# EAGLE design analog_frontend (EAGLE 9.5.2)
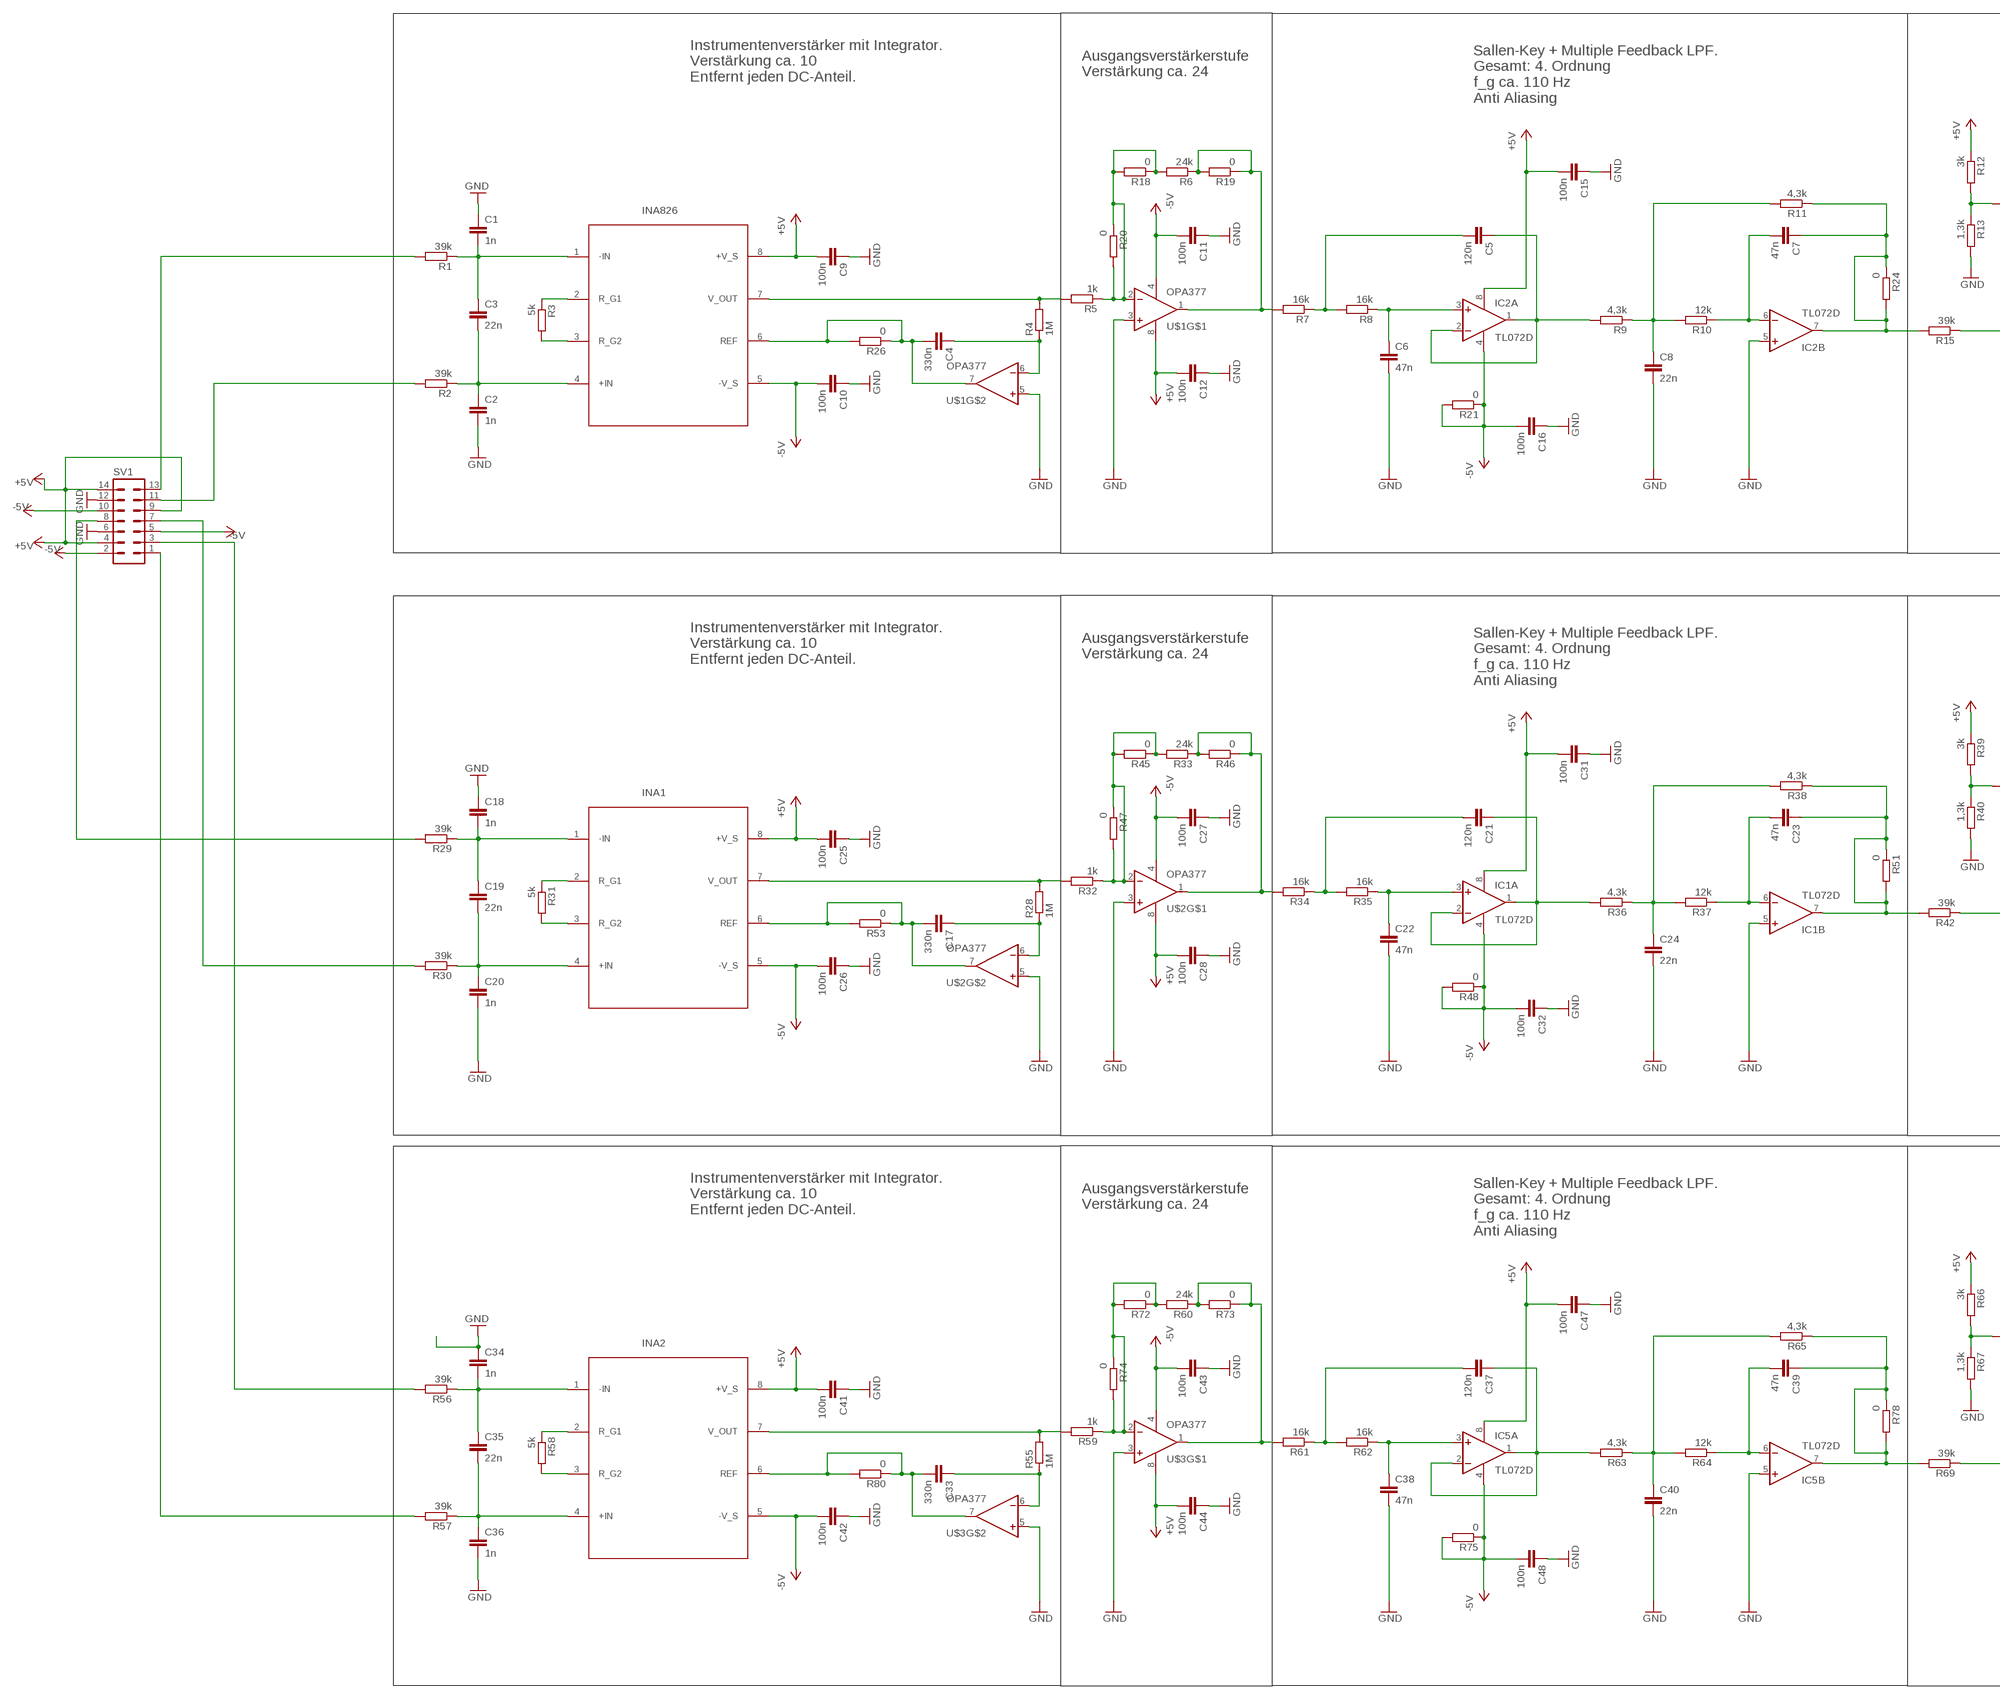
[diagram p0: schematic, sheet 1, part 1 of 2]
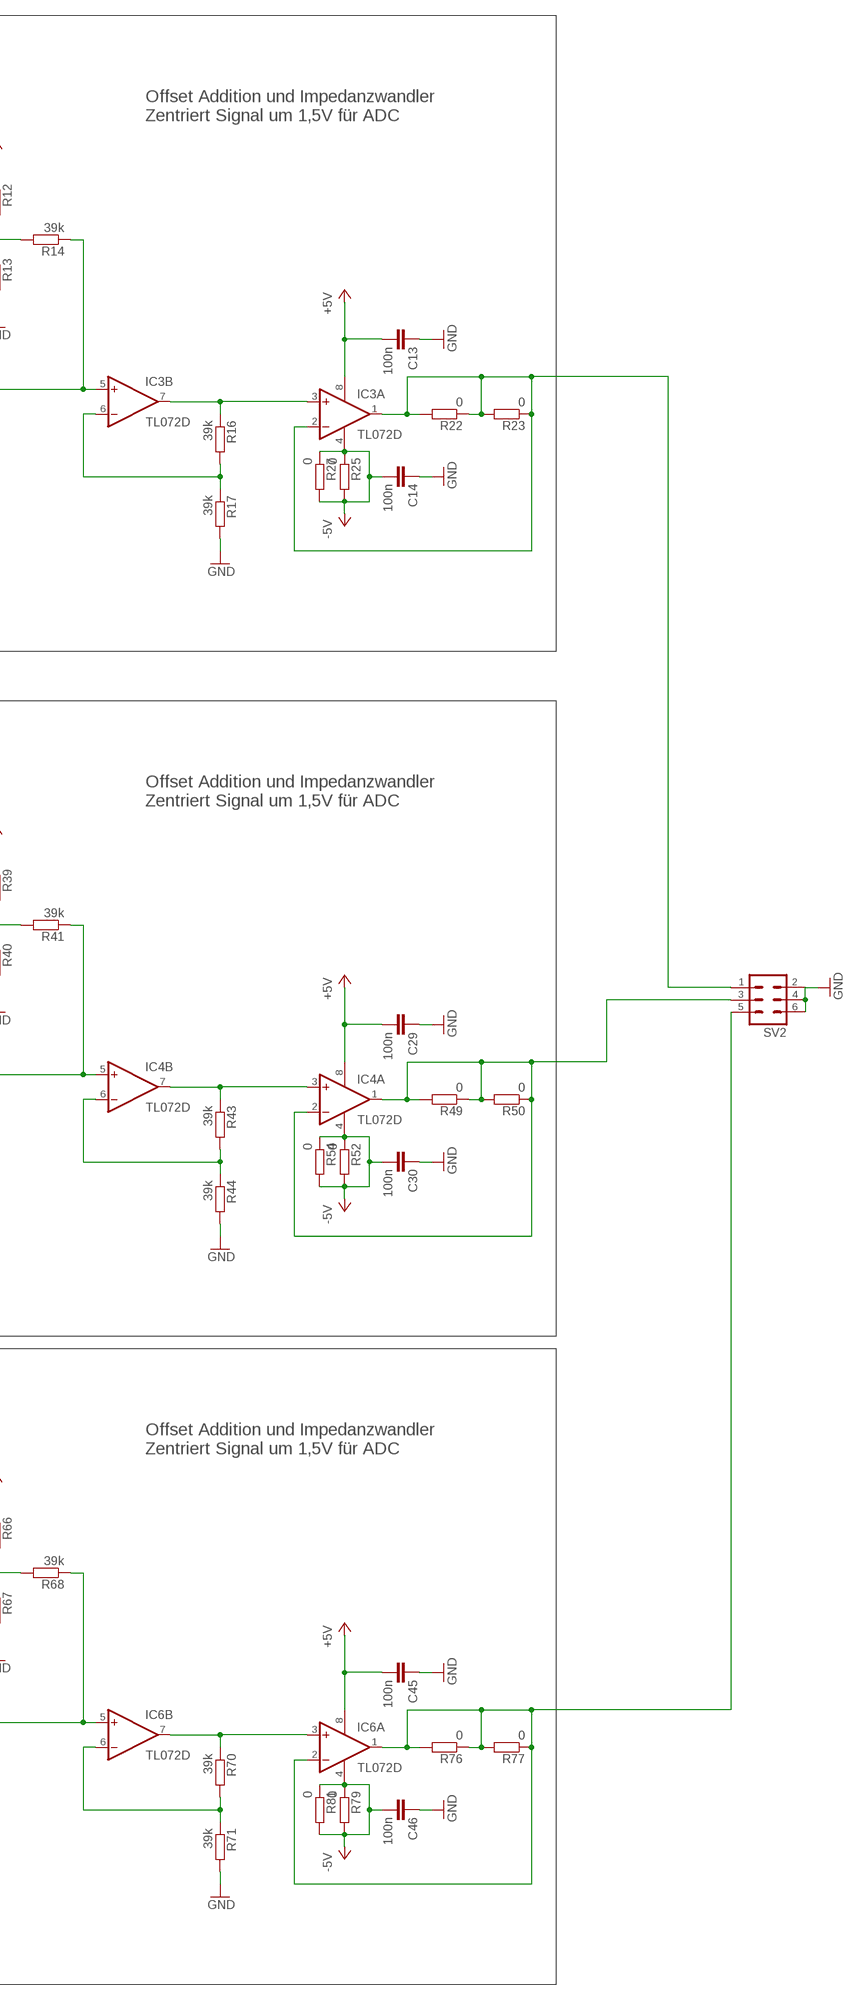
[diagram p1: schematic, sheet 1, part 2 of 2]

## Parts
C1  1n  C-EUC0805  [C0805]
C2  1n  C-EUC0805  [C0805]
C3  22n  C-EUC0805  [C0805]
C4  330n  C-EUC1206  [C1206]
C5  120n  C-EUC0805  [C0805]
C6  47n  C-EUC0805  [C0805]
C7  47n  C-EUC0805  [C0805]
C8  22n  C-EUC0805  [C0805]
C9  100n  C-EUC0805  [C0805]
C10  100n  C-EUC0805  [C0805]
C11  100n  C-EUC0805  [C0805]
C12  100n  C-EUC0805  [C0805]
C13  100n  C-EUC0805  [C0805]
C14  100n  C-EUC0805  [C0805]
C15  100n  C-EUC1206  [C1206]
C16  100n  C-EUC0805  [C0805]
C17  330n  C-EUC1206  [C1206]
C18  1n  C-EUC0805  [C0805]
C19  22n  C-EUC0805  [C0805]
C20  1n  C-EUC0805  [C0805]
C21  120n  C-EUC0805  [C0805]
C22  47n  C-EUC0805  [C0805]
C23  47n  C-EUC0805  [C0805]
C24  22n  C-EUC0805  [C0805]
C25  100n  C-EUC0805  [C0805]
C26  100n  C-EUC0805  [C0805]
C27  100n  C-EUC0805  [C0805]
C28  100n  C-EUC0805  [C0805]
C29  100n  C-EUC0805  [C0805]
C30  100n  C-EUC0805  [C0805]
C31  100n  C-EUC1206  [C1206]
C32  100n  C-EUC0805  [C0805]
C33  330n  C-EUC1206  [C1206]
C34  1n  C-EUC0805  [C0805]
C35  22n  C-EUC0805  [C0805]
C36  1n  C-EUC0805  [C0805]
C37  120n  C-EUC0805  [C0805]
C38  47n  C-EUC0805  [C0805]
C39  47n  C-EUC0805  [C0805]
C40  22n  C-EUC0805  [C0805]
C41  100n  C-EUC0805  [C0805]
C42  100n  C-EUC0805  [C0805]
C43  100n  C-EUC0805  [C0805]
C44  100n  C-EUC0805  [C0805]
C45  100n  C-EUC0805  [C0805]
C46  100n  C-EUC0805  [C0805]
C47  100n  C-EUC1206  [C1206]
C48  100n  C-EUC0805  [C0805]
IC1  TL072D  [SO08]
IC2  TL072D  [SO08]
IC3  TL072D  [SO08]
IC4  TL072D  [SO08]
IC5  TL072D  [SO08]
IC6  TL072D  [SO08]
INA1  INA826  [SOIC8]
INA2  INA826  [SOIC8]
INA826  INA826  [SOIC8]
R1  39k  R-EU_R0805  [R0805]
R2  39k  R-EU_R0805  [R0805]
R3  5k  R-EU_R0805  [R0805]
R4  1M  R-EU_R1206  [R1206]
R5  1k  R-EU_R1206  [R1206]
R6  24k  R-EU_R0805  [R0805]
R7  16k  R-EU_R1206  [R1206]
R8  16k  R-EU_R0805  [R0805]
R9  4,3k  R-EU_R0805  [R0805]
R10  12k  R-EU_R0805  [R0805]
R11  4,3k  R-EU_R0805  [R0805]
R12  3k  R-EU_R0805  [R0805]
R13  1,3k  R-EU_R1206  [R1206]
R14  39k  R-EU_R0805  [R0805]
R15  39k  R-EU_R0805  [R0805]
R16  39k  R-EU_R0805  [R0805]
R17  39k  R-EU_R1206  [R1206]
R18  0  R-EU_R1206  [R1206]
R19  0  R-EU_R1206  [R1206]
R20  0  R-EU_R1206  [R1206]
R21  0  R-EU_R1206  [R1206]
R22  0  R-EU_R1206  [R1206]
R23  0  R-EU_R1206  [R1206]
R24  0  R-EU_R1206  [R1206]
R25  0  R-EU_R1206  [R1206]
R26  0  R-EU_R1206  [R1206]
R27  0  R-EU_R1206  [R1206]
R28  1M  R-EU_R1206  [R1206]
R29  39k  R-EU_R0805  [R0805]
R30  39k  R-EU_R0805  [R0805]
R31  5k  R-EU_R0805  [R0805]
R32  1k  R-EU_R1206  [R1206]
R33  24k  R-EU_R0805  [R0805]
R34  16k  R-EU_R1206  [R1206]
R35  16k  R-EU_R0805  [R0805]
R36  4,3k  R-EU_R0805  [R0805]
R37  12k  R-EU_R0805  [R0805]
R38  4,3k  R-EU_R0805  [R0805]
R39  3k  R-EU_R0805  [R0805]
R40  1,3k  R-EU_R1206  [R1206]
R41  39k  R-EU_R0805  [R0805]
R42  39k  R-EU_R0805  [R0805]
R43  39k  R-EU_R0805  [R0805]
R44  39k  R-EU_R1206  [R1206]
R45  0  R-EU_R1206  [R1206]
R46  0  R-EU_R1206  [R1206]
R47  0  R-EU_R1206  [R1206]
R48  0  R-EU_R1206  [R1206]
R49  0  R-EU_R1206  [R1206]
R50  0  R-EU_R1206  [R1206]
R51  0  R-EU_R1206  [R1206]
R52  0  R-EU_R1206  [R1206]
R53  0  R-EU_R1206  [R1206]
R54  0  R-EU_R1206  [R1206]
R55  1M  R-EU_R1206  [R1206]
R56  39k  R-EU_R0805  [R0805]
R57  39k  R-EU_R0805  [R0805]
R58  5k  R-EU_R0805  [R0805]
R59  1k  R-EU_R1206  [R1206]
R60  24k  R-EU_R0805  [R0805]
R61  16k  R-EU_R1206  [R1206]
R62  16k  R-EU_R0805  [R0805]
R63  4,3k  R-EU_R0805  [R0805]
R64  12k  R-EU_R0805  [R0805]
R65  4,3k  R-EU_R0805  [R0805]
R66  3k  R-EU_R0805  [R0805]
R67  1,3k  R-EU_R1206  [R1206]
R68  39k  R-EU_R0805  [R0805]
R69  39k  R-EU_R0805  [R0805]
R70  39k  R-EU_R0805  [R0805]
R71  39k  R-EU_R1206  [R1206]
R72  0  R-EU_R1206  [R1206]
R73  0  R-EU_R1206  [R1206]
R74  0  R-EU_R1206  [R1206]
R75  0  R-EU_R1206  [R1206]
R76  0  R-EU_R1206  [R1206]
R77  0  R-EU_R1206  [R1206]
R78  0  R-EU_R1206  [R1206]
R79  0  R-EU_R1206  [R1206]
R80  0  R-EU_R1206  [R1206]
R81  0  R-EU_R1206  [R1206]
SV1  ML14L  [ML14L]
SV2  ML6L  [ML6L]
U$1  OPA377  [SOIC8]
U$2  OPA377  [SOIC8]
U$3  OPA377  [SOIC8]

## Nets
+5V: C9.2 C12.2 C13.2 C15.2 C25.2 C28.2 C29.2 C31.2 C41.2 C44.2 C45.2 C47.2 IC1.8(P:V+) IC2.8(P:V+) IC3.8(P:V+) IC4.8(P:V+) IC5.8(P:V+) IC6.8(P:V+) INA1.8(+V_S) INA2.8(+V_S) INA826.8(+V_S) R12.1 R39.1 R66.1 SV1.4 SV1.9 SV1.14 U$1.8(V+) U$2.8(V+) U$3.8(V+)
-5V: C10.2 C11.2 C14.2 C16.2 C26.2 C27.2 C30.2 C32.2 C42.2 C43.2 C46.2 C48.2 IC1.4(P:V-) IC2.4(P:V-) IC3.4(P:V-) IC4.4(P:V-) IC5.4(P:V-) IC6.4(P:V-) INA1.5(-V_S) INA2.5(-V_S) INA826.5(-V_S) R21.1 R21.2 R25.1 R25.2 R27.1 R27.2 R48.1 R48.2 R52.1 R52.2 R54.1 R54.2 R75.1 R75.2 R79.1 R79.2 R81.1 R81.2 SV1.2 SV1.5 SV1.10 U$1.4(V-) U$2.4(V-) U$3.4(V-)
GND: C1.1 C2.2 C6.2 C8.2 C9.1 C10.1 C11.1 C12.1 C13.1 C14.1 C15.1 C16.1 C18.1 C20.2 C22.2 C24.2 C25.1 C26.1 C27.1 C28.1 C29.1 C30.1 C31.1 C32.1 C34.1 C36.2 C38.2 C40.2 C41.1 C42.1 C43.1 C44.1 C45.1 C46.1 C47.1 C48.1 IC1.5(B:+IN) IC2.5(B:+IN) IC5.5(B:+IN) R13.2 R17.2 R40.2 R44.2 R67.2 R71.2 SV1.6 SV1.12 SV2.2 SV2.4 SV2.6 U$1.3(+IN) U$1.5(+IN) U$2.3(+IN) U$2.5(+IN) U$3.3(+IN) U$3.5(+IN)
N$1: C4.2 INA826.6(REF) R26.1 R26.2 U$1.7(OUT)
N$2: C4.1 R4.1 U$1.6(-IN)
N$3: INA826.7(V_OUT) R4.2 R5.2
N$4: C1.2 C3.1 INA826.1(-IN) R1.1
N$5: C2.1 C3.2 INA826.4(+IN) R2.1
N$6: INA826.3(R_G2) R3.2
N$7: INA826.2(R_G1) R3.1
N$8: R5.1 R6.2 R18.1 R18.2 R20.1 R20.2 U$1.2(-IN)
N$9: R6.1 R7.2 R19.1 R19.2 U$1.1(OUT)
N$10: C5.2 R7.1 R8.2
N$11: C5.1 IC2.1(A:OUT) IC2.2(A:-IN) R9.2
N$12: C6.1 IC2.3(A:+IN) R8.1
N$13: C8.1 R9.1 R10.2 R11.2
N$14: C7.2 IC2.6(B:-IN) R10.1
N$15: C7.1 IC2.7(B:OUT) R11.1 R15.2 R24.1 R24.2
N$16: IC3.5(B:+IN) R14.1 R15.1
N$17: IC3.6(B:-IN) R16.2 R17.1
N$18: R12.2 R13.1 R14.2
N$19: IC3.3(A:+IN) IC3.7(B:OUT) R16.1
N$20: IC3.1(A:OUT) IC3.2(A:-IN) R22.1 R22.2 R23.1 R23.2 SV2.1
N$21: R1.2 SV1.13
N$22: R2.2 SV1.11
N$23: INA1.7(V_OUT) R28.2 R32.2
N$24: C17.1 R28.1 U$2.6(-IN)
N$25: C18.2 C19.1 INA1.1(-IN) R29.1
N$26: C19.2 C20.1 INA1.4(+IN) R30.1
N$27: INA1.3(R_G2) R31.2
N$28: INA1.2(R_G1) R31.1
N$29: C21.2 R34.1 R35.2
N$30: C21.1 IC1.1(A:OUT) IC1.2(A:-IN) R36.2
N$31: C22.1 IC1.3(A:+IN) R35.1
N$32: C24.1 R36.1 R37.2 R38.2
N$33: C23.2 IC1.6(B:-IN) R37.1
N$34: C23.1 IC1.7(B:OUT) R38.1 R42.2 R51.1 R51.2
N$35: IC4.5(B:+IN) R41.1 R42.1
N$36: R39.2 R40.1 R41.2
N$37: IC4.3(A:+IN) IC4.7(B:OUT) R43.1
N$38: IC4.6(B:-IN) R43.2 R44.1
N$39: R32.1 R33.2 R45.1 R45.2 R47.1 R47.2 U$2.2(-IN)
N$40: IC4.1(A:OUT) IC4.2(A:-IN) R49.1 R49.2 R50.1 R50.2 SV2.3
N$41: C17.2 INA1.6(REF) R53.1 R53.2 U$2.7(OUT)
N$42: R33.1 R34.2 R46.1 R46.2 U$2.1(OUT)
N$43: R29.2 SV1.8
N$44: R30.2 SV1.7
N$45: INA2.7(V_OUT) R55.2 R59.2
N$46: C33.1 R55.1 U$3.6(-IN)
N$47: C34.2 C35.1 INA2.1(-IN) R56.1
N$48: C35.2 C36.1 INA2.4(+IN) R57.1
N$49: INA2.3(R_G2) R58.2
N$50: INA2.2(R_G1) R58.1
N$51: C37.2 R61.1 R62.2
N$52: C37.1 IC5.1(A:OUT) IC5.2(A:-IN) R63.2
N$53: C38.1 IC5.3(A:+IN) R62.1
N$54: C40.1 R63.1 R64.2 R65.2
N$55: C39.2 IC5.6(B:-IN) R64.1
N$56: C39.1 IC5.7(B:OUT) R65.1 R69.2 R78.1 R78.2
N$57: IC6.5(B:+IN) R68.1 R69.1
N$58: R66.2 R67.1 R68.2
N$59: IC6.3(A:+IN) IC6.7(B:OUT) R70.1
N$60: IC6.6(B:-IN) R70.2 R71.1
N$61: R59.1 R60.2 R72.1 R72.2 R74.1 R74.2 U$3.2(-IN)
N$62: IC6.1(A:OUT) IC6.2(A:-IN) R76.1 R76.2 R77.1 R77.2 SV2.5
N$63: C33.2 INA2.6(REF) R80.1 R80.2 U$3.7(OUT)
N$64: R60.1 R61.2 R73.1 R73.2 U$3.1(OUT)
N$65: R56.2 SV1.3
N$66: R57.2 SV1.1

## Notes on the sheet
- Instrumentenverstärker mit Integrator. 
  Verstärkung ca. 10
  Entfernt jeden DC-Anteil.
- Ausgangsverstärkerstufe
  Verstärkung ca. 24
- Sallen-Key + Multiple Feedback LPF.
  Gesamt: 4. Ordnung 
  f_g ca. 110 Hz
  Anti Aliasing
- Offset Addition und Impedanzwandler
  Zentriert Signal um 1,5V für ADC
- Instrumentenverstärker mit Integrator. 
  Verstärkung ca. 10
  Entfernt jeden DC-Anteil.
- Ausgangsverstärkerstufe
  Verstärkung ca. 24
- Sallen-Key + Multiple Feedback LPF.
  Gesamt: 4. Ordnung 
  f_g ca. 110 Hz
  Anti Aliasing
- Offset Addition und Impedanzwandler
  Zentriert Signal um 1,5V für ADC
- Instrumentenverstärker mit Integrator. 
  Verstärkung ca. 10
  Entfernt jeden DC-Anteil.
- Ausgangsverstärkerstufe
  Verstärkung ca. 24
- Sallen-Key + Multiple Feedback LPF.
  Gesamt: 4. Ordnung 
  f_g ca. 110 Hz
  Anti Aliasing
- Offset Addition und Impedanzwandler
  Zentriert Signal um 1,5V für ADC

## Library data of the parts
C1-C48 = rcl:C-EU: CAPACITOR, European symbol; SPICEPREFIX: C
IC1-IC6 = linear:TL072: OP AMP
INA1 INA2 INA826 = INA826:INA826: INA826AIDR Texas Instruments InAmp https://www.ti.com/lit/ds/symlink/ina826.pdf
R1-R81 = rcl:R-EU_: RESISTOR, European symbol; SPICEPREFIX: R
SV1 = con-harting-ml:ML14: HARTING; OC_FARNELL: unknown; OC_NEWARK: unknown
SV2 = con-harting-ml:ML6: HARTING; OC_FARNELL: unknown; OC_NEWARK: unknown
U$1-U$3 = OPA377:OPA377

## Board
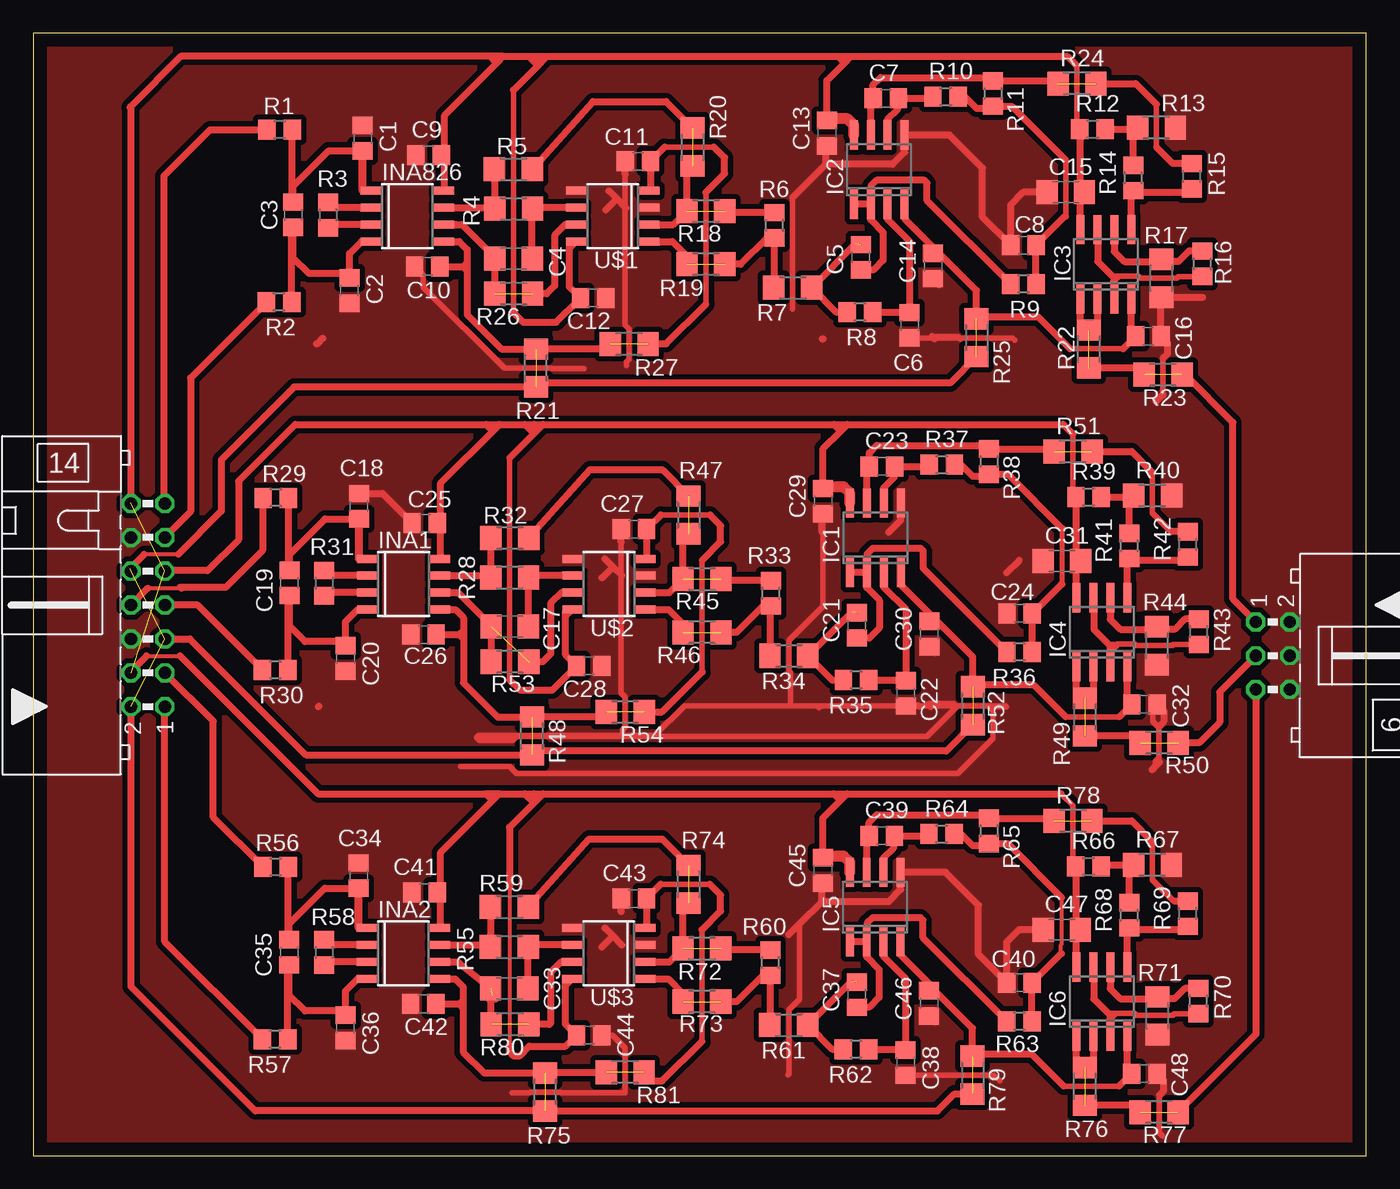
[diagram p2: board, top side]

Size 100 x 84.2 mm. Coordinates in mm from the lower left corner, seen from the top.
Outline: 0,0 100,0 100,84.2 0,84.2 0,0
Copper layers (1*16): Top 0.035mm / dielectric 1.5mm / Bottom 0.035mm
Design rules "default *": minimum track width 6mil, minimum drill 0.35mm, track to track 0.4mm, track to pad 0.4mm, pad to pad 0.25mm, via to via 0.25mm, smd to smd 0.25mm, copper to edge 40mil, drill to drill 1mm, minimum pad ring 10mil, minimum via ring 8mil, stop-mask expansion 4mil, vias tented up to drill 0mil, thermal gap 10mil

### Footprints (pad centres in the part's own frame; a part is rotated, then mirrored left to right if it is on the bottom)
C0805 = smd 1.3 x 1.5: 1 -0.95,0; 2 0.95,0
C1206 = smd 1.6 x 1.8: 1 -1.4,0; 2 1.4,0
SO08 = smd 0.6 x 2.2: 1 -1.905,-2.6; 2 -0.635,-2.6; 3 0.635,-2.6; 4 1.905,-2.6; 5 1.905,2.6; 6 0.635,2.6; 7 -0.635,2.6; 8 -1.905,2.6
SOIC8 = smd 0.6 x 1.5: 1 -1.905,-2.75; 2 -0.635,-2.75; 3 0.635,-2.75; 4 1.905,-2.75; 5 1.905,2.75; 6 0.635,2.75; 7 -0.635,2.75; 8 -1.905,2.75
R0805 = smd 1.3 x 1.5: 1 -0.95,0; 2 0.95,0
R1206 = smd 1.6 x 1.803: 1 -1.422,0; 2 1.422,0
ML14L = drill 0.914 octagon: 1 -7.62,-1.27; 2 -7.62,1.27; 3 -5.08,-1.27; 4 -5.08,1.27; 5 -2.54,-1.27; 6 -2.54,1.27; 7 0,-1.27; 8 0,1.27; 9 2.54,-1.27; 10 2.54,1.27; 11 5.08,-1.27; 12 5.08,1.27; 13 7.62,-1.27; 14 7.62,1.27
ML6L = drill 0.914 octagon: 1 -2.54,-1.27; 2 -2.54,1.27; 3 0,-1.27; 4 0,1.27; 5 2.54,-1.27; 6 2.54,1.27

### Placement (x,y rotation side)
C1  24.72,76.33 270 top
C2  23.72,64.9 270 top
C3  19.51,70.58 270 top
C4  36.03,67.3 180 top
C5  62.08,67.39 90 top
C6  65.74,62.29 270 top
C7  63.96,79.32 0 top
C8  74.28,68.29 180 top
C9  29.66,75.06 0 top
C10  29.56,66.7 0 top
C11  45.35,74.6 0 top
C12  42,64.35 180 top
C13  59.54,76.71 90 top
C14  67.51,66.74 90 top
C15  77.46,72.27 0 top
C16  83.66,61.47 180 top
C17  35.74,39.7 180 top
C18  24.43,48.72 270 top
C19  19.22,42.97 270 top
C20  23.43,37.29 270 top
C21  61.79,39.78 90 top
C22  65.45,34.68 270 top
C23  63.67,51.71 0 top
C24  73.99,40.68 180 top
C25  29.37,47.45 0 top
C26  29.27,39.09 0 top
C27  45.06,46.99 0 top
C28  41.71,36.74 180 top
C29  59.25,49.1 90 top
C30  67.22,39.13 90 top
C31  77.17,44.61 0 top
C32  83.37,33.86 180 top
C33  35.71,12.55 180 top
C34  24.42,21.01 270 top
C35  19.21,15.26 270 top
C36  23.42,9.58 270 top
C37  61.78,12.07 90 top
C38  65.44,6.97 270 top
C39  63.66,24 0 top
C40  73.98,12.97 180 top
C41  29.36,19.74 0 top
C42  29.26,11.38 0 top
C43  45.05,19.28 0 top
C44  41.7,9.03 180 top
C45  59.24,21.39 90 top
C46  67.21,11.42 90 top
C47  77.16,16.95 0 top
C48  83.36,6.15 180 top
IC1  63.17,46.36 0 top
IC2  63.46,73.97 0 top
IC3  80.46,66.87 0 top
IC4  80.17,39.26 0 top
IC5  63.16,18.65 0 top
IC6  80.16,11.55 0 top
INA1  27.78,42.87 270 top
INA2  27.77,15.16 270 top
INA826  28.07,70.48 270 top
R1  18.48,76.96 180 top
R2  18.44,64.04 180 top
R3  22.12,70.56 270 top
R4  36.04,71.03 180 top
R5  36.02,73.99 180 top
R6  55.62,69.79 90 top
R7  56.98,65.11 180 top
R8  62.02,63.29 180 top
R9  74.28,65.39 180 top
R10  68.44,79.45 0 top
R11  72,79.68 270 top
R12  79.46,77.02 0 top
R13  84.26,77.12 0 top
R14  82.52,73.35 90 top
R15  86.91,73.47 90 top
R16  87.72,66.91 90 top
R17  84.63,65.81 270 top
R18  50.46,70.87 180 top
R19  50.46,66.87 0 top
R20  49.46,75.67 90 top
R21  37.71,59.09 270 top
R22  79.2,60.51 270 top
R23  84.76,58.58 0 top
R24  78.3,80.43 0 top
R25  70.77,61.36 90 top
R26  36.04,64.66 0 top
R27  44.7,60.88 0 top
R28  35.74,43.37 180 top
R29  18.19,49.35 180 top
R30  18.15,36.43 180 top
R31  21.83,42.95 270 top
R32  35.75,46.34 180 top
R33  55.33,42.18 90 top
R34  56.69,37.5 180 top
R35  61.73,35.68 180 top
R36  73.99,37.78 180 top
R37  68.15,51.84 0 top
R38  71.71,52.07 270 top
R39  79.17,49.41 0 top
R40  83.97,49.51 0 top
R41  82.23,45.74 90 top
R42  86.62,45.86 90 top
R43  87.43,39.3 90 top
R44  84.31,38.25 270 top
R45  50.17,43.26 180 top
R46  50.17,39.26 0 top
R47  49.17,48.06 90 top
R48  37.42,31.48 270 top
R49  78.91,32.9 270 top
R50  84.47,30.97 0 top
R51  78.01,52.82 0 top
R52  70.48,33.75 90 top
R53  35.76,37.05 0 top
R54  44.41,33.27 0 top
R55  35.71,15.65 180 top
R56  18.18,21.64 180 top
R57  18.14,8.72 180 top
R58  21.82,15.24 270 top
R59  35.71,18.65 180 top
R60  55.32,14.47 90 top
R61  56.68,9.79 180 top
R62  61.72,7.97 180 top
R63  73.98,10.07 180 top
R64  68.14,24.13 0 top
R65  71.7,24.36 270 top
R66  79.16,21.7 0 top
R67  83.96,21.8 0 top
R68  82.22,18.03 90 top
R69  86.61,18.15 90 top
R70  87.42,11.59 90 top
R71  84.33,10.49 270 top
R72  50.16,15.55 180 top
R73  50.16,11.55 0 top
R74  49.16,20.35 90 top
R75  38.41,4.77 270 top
R76  78.9,5.19 270 top
R77  84.46,3.26 0 top
R78  78,25.11 0 top
R79  70.47,6.04 90 top
R80  35.76,9.84 0 top
R81  44.4,6.26 0 top
SV1  8.6,41.3 90 top
SV2  93,37.5 270 top
U$1  43.48,70.48 90 top
U$2  43.19,42.87 90 top
U$3  43.18,15.16 90 top

### Tracks (layer width: path | path; a pad name or v marks a point on that pad's centre or on a via)
+5V  (3 unrouted)
  Top 0.305: 8.49,37.49 11.01,37.49 | 35.73,20.2 35.73,8.3
  Top 0.4: 78.29,77.24 78.29,81.76 | 36.03,63.26 36.03,79.95 | 78,49.63 78,54.14 | 35.74,35.7 35.74,52.34
  Top 0.406: 77.1,27.15 77.99,26.26 77.99,21.92
  Top 0.508: 35.26,82.47 37.17,82.47 | 37.17,82.47 37.86,82.47 | 37.86,82.47 38.55,82.47 | IC3.8 78.56,72.12 78.51,72.17 | 78.51,72.17 C15.2 | 78.51,72.17 R12.1 78.29,77.24 | INA826.8 30.82,74.85 C9.2 30.86,75.07 30.86,78.07 34.91,82.12 | 36.03,63.26 36.76,62.53 39.23,62.53 C12.2 40.23,65.17 40.23,68.08 | 40.23,68.08 40.23,68.48 40.36,68.48 | U$1.8 40.23,68.08 | 59.54,77.78 C13.2 59.54,80.65 60.87,81.97 | 35.26,82.47 34.26,82.47 | 34.91,82.12 35.26,82.47 | 36.03,79.95 37.86,81.78 | 37.86,81.78 38.06,81.98 | 38.06,81.98 38.55,82.47 | 34.26,82.47 34.6,82.12 34.91,82.12 | 37.17,82.47 37.86,81.78 | 37.86,82.47 38.06,82.27 38.06,81.98 | 38.55,82.47 60.36,82.47 | 60.36,82.47 61.36,82.47 | 60.87,81.97 61.36,82.47 | 60.36,82.47 60.85,81.97 60.87,81.97 | 61.36,82.47 77.58,82.47 78.29,81.76 | 34.97,54.86 36.88,54.86 | 36.88,54.86 37.57,54.86 | 37.57,54.86 38.26,54.86 | IC4.8 78.27,44.52 78.26,44.52 | 78.26,44.52 C31.2 | 78.26,44.52 78.22,44.56 R39.1 78,49.63 | INA1.8 30.53,47.24 C25.2 30.57,47.46 30.57,50.46 34.62,54.52 | 35.74,35.7 36.52,34.92 38.94,34.92 C28.2 39.94,37.56 39.94,40.47 | 39.94,40.47 39.94,40.87 40.07,40.87 | U$2.8 39.94,40.47 | 59.25,50.17 C29.2 59.25,53.04 60.58,54.37 | 33.97,54.86 34.97,54.86 | 34.62,54.52 34.97,54.86 | 35.74,52.34 37.57,54.17 | 37.57,54.17 37.77,54.37 | 37.77,54.37 38.26,54.86 | 33.97,54.86 34.31,54.52 34.62,54.52 | 36.88,54.86 37.57,54.17 | 37.57,54.86 37.77,54.66 37.77,54.37 | 38.26,54.86 60.07,54.86 | 60.07,54.86 61.07,54.86 | 60.58,54.37 61.07,54.86 | 60.07,54.86 60.56,54.37 60.58,54.37 | 61.07,54.86 77.28,54.86 78,54.14 | 34.96,27.15 36.87,27.15 | 36.87,27.15 37.56,27.15 | 37.56,27.15 38.25,27.15 | IC6.8 78.25,16.8 78.21,16.85
  Top 0.508: 78.21,16.85 C47.2 | 78.21,16.85 R66.1 77.99,21.92 | INA2.8 30.52,19.53 C41.2 30.56,19.75 30.56,22.75 34.62,26.8 | 39.93,12.76 39.93,9.85 C44.2 39.93,8.21 37.21,8.21 36.5,7.5 36,7.5 35.73,7.77 35.73,8.3 | 39.93,12.76 39.93,13.16 40.06,13.16 | U$3.8 39.93,12.76 | 59.24,22.46 C45.2 59.24,25.33 60.56,26.66 | 34.96,27.15 33.96,27.15 | 34.62,26.8 34.96,27.15 | 37.56,26.46 35.73,24.63 35.73,20.2 | 37.56,26.46 37.76,26.66 | 37.76,26.66 38.25,27.15 | 33.96,27.15 34.3,26.8 34.62,26.8 | 36.87,27.15 37.56,26.46 | 37.56,27.15 37.76,26.95 37.76,26.66 | 38.25,27.15 60.06,27.15 | 60.06,27.15 61.06,27.15 | 60.56,26.66 61.06,27.15 | 60.06,27.15 60.55,26.66 60.56,26.66 | 61.06,27.15 77.1,27.15 | 34.26,82.47 11.07,82.47 7.3,78.7 | 7.3,78.7 7.25,78.65 | 33.97,54.86 19.66,54.86 15.4,50.6 15.4,46.2 13.08,43.88 9.91,43.88 SV1.9 | 7.3,78.7 7.3,48.95 | SV1.4 7.33,36.33 8.49,37.49 | 33.96,27.15 21.35,27.15 11.01,37.49
  Top 0.813: IC2.8 61.55,77.31 61.09,77.78 59.54,77.78 | IC1.8 61.27,49.7 60.8,50.17 59.25,50.17 | IC5.8 61.26,21.99 60.79,22.46 59.24,22.46
-5V  (12 unrouted)
  Top 0.152: C14.2 67.46,67.74 67.46,68.21
  Top 0.305: 10.87,45.11 8.31,45.11
  Top 0.4: 50.46,72.27 50.46,63.9 | 51.06,75.67 47.37,75.67 | 81.77,60.53 77.78,60.53
  Top 0.406: 50.17,44.66 50.17,36.29 | 50.77,48.06 47.08,48.06 | 81.47,32.91 77.45,32.91 | 50.16,16.95 50.16,8.58 | 50.76,20.35 47.07,20.35 | 81.46,5.2 77.3,5.2
  Top 0.508: INA826.5 31.95,68.58 32.56,67.97 32.56,66.98 | U$1.4 46.3,72.45 C11.2 47.37,75.67 | 50.46,72.27 51.86,73.67 51.86,74.87 51.06,75.67 | 50.46,63.87 50.46,63.9 47.47,60.91 46.15,60.91 R27.2 | 81.77,60.53 C16.2 82.36,61.81 IC3.4 | R25.2 71.13,63.14 | R25.2 70.9,62.91 75.4,62.91 77.78,60.53 | R25.1 68.79,57.96 38,57.96 R21.2 19.57,57.67 14.1,52.2 14.1,48.34 10.87,45.11 | R21.1 38.08,60.88 | R27.1 42.91,60.51 R21.1 | 32.56,66.98 32.56,66.38 | 32.56,66.38 32.56,63.08 35.13,60.51 R21.1 | C10.2 32.24,66.7 | 32.24,66.7 32.56,66.38 | 32.24,66.7 32.28,66.7 32.56,66.98 | IC2.4 65.36,70.31 67.46,68.21 70.77,64.9 R25.2 | INA1.5 31.66,40.97 32.27,40.36 32.27,39.37 | U$2.4 46.01,44.84 C27.2 47.08,48.06 | 50.17,44.66 51.57,46.06 51.57,47.26 50.77,48.06 | 50.17,36.26 50.17,36.29 47.18,33.3 45.86,33.3 R54.2 | 81.47,32.91 C32.2 82.08,34.2 IC4.4 | R52.2 70.84,35.53 | R52.2 70.61,35.3 75.06,35.3 77.45,32.91 | R52.1 68.5,30.35 37.71,30.35 R48.2 20.44,30.06 11.74,38.76 SV1.5 | R48.1 37.79,33.27 | R54.1 42.62,32.9 R48.1 | 32.27,39.37 32.27,38.77 | 32.27,38.77 32.27,35.47 34.84,32.9 R48.1 | C26.2 31.95,39.09 | 31.95,39.09 32.27,38.77 | 31.95,39.09 31.99,39.09 32.27,39.37 | IC1.4 65.08,42.83 67.22,40.68 | 67.22,40.68 C30.2 | R52.2 70.48,37.42 67.22,40.68 | INA2.5 31.66,13.26 32.26,12.65 32.26,11.66 | U$3.4 46,17.14 C43.2 47.07,20.35 | 50.16,16.95 51.56,18.35 51.56,19.55 50.76,20.35 | 50.16,8.55 50.16,8.58 47.17,5.59 46.49,5.59 R81.2 | 81.46,5.2 C48.2 82.06,6.5 IC6.4 | R79.2 70.83,7.82 | R79.2 70.6,7.59 74.91,7.59 77.3,5.2 | R75.1 38.78,6.56 | R81.1 42.91,6.19 R75.1 | 32.26,11.66 32.26,11.06 | 32.26,11.06 32.26,7.76 33.83,6.19 R75.1 | C42.2 31.94,11.38
  Top 0.508: 31.94,11.38 32.26,11.06 | 31.94,11.38 31.98,11.38 32.26,11.66 | IC5.4 65.06,15.05 67.21,12.91 67.21,12.82 | 67.21,12.82 C46.2 | R79.2 70.47,9.56 67.21,12.82 | 7.25,44.05 8.31,45.11 | SV1.2 7.33,12.67 16.65,3.35 R75.2 67.85,3.35 69.12,4.62 R79.1
GND
  Top 0.4: 84.76,59.82 84.76,57.09 | 67.43,61.45 69.38,61.45 69.56,61.27 | 56.97,71.88 56.97,63.5 | C32.1 84.32,33.74 84,33.42 84,32.57 84.45,32.12 84.45,29.82 84.19,29.56 84.19,29.2 | 71.69,33.67 73.02,33.67 72.96,33.73 C22.2 56.82,33.73 | 71.69,33.67 71.63,33.73 69.33,33.73 | 67.82,33.84 67.93,33.73 69.33,33.73 | 56.82,33.73 48.84,33.73 46.61,31.5 44.19,31.5 | 44.19,31.5 33.39,31.5 33.26,31.37 33.47,31.16 35.97,31.16 36.27,31.46 67.06,31.46 69.33,33.73 | 71.69,33.67 71.98,33.38 71.98,31.28 69.36,28.66 36.27,28.66 35.72,29.2 32.05,29.2 | 57.49,17.38 57.49,11.73 56.7,10.94 56.7,6.13 56.62,6.05 | C10.1 29.26,66.05 29.26,65.17 35.36,59.07 38.86,59.07 38.87,59.06 41.32,59.06 | C6.2 73.47,61.34 73.63,61.18 | C11.1 44.4,62.31 44.68,62.03 44.68,59.73 44.52,59.57 44.52,59.27 | C29.1 59.25,41.19 56.71,38.65 56.71,36.35 56.82,36.24 56.82,33.73 | C27.1 44.11,34.7 44.39,34.42 44.39,32.12 44.19,31.92 44.19,31.5
  Top 0.406: C44.1 43.47,9.03 44.4,8.1 44.4,4.7 39.61,4.7 39.56,4.75 37.26,4.75 37.21,4.7 35.9,4.7 | C38.2 69.32,6.02 72.08,6.02 72.5,5.6 | 84.5,4.54 84.48,4.52 84.48,1.72 84.7,1.5
  Top 0.508: C9.1 28.61,74.96 | 44.4,73.61 C11.1 | 44.45,71.11 43.77,71.78 | 43.77,71.78 43.17,72.39 | 42.95,70.96 43.77,71.78 | 59.46,74.37 64.46,74.37 65.36,75.28 IC2.5 68.74,76.57 71.22,74.09 71.22,70.4 C8.2 73.33,71.34 74.26,72.27 C15.1 | 85.83,77.27 R13.2 | 67.43,61.45 67.61,61.27 | 65.63,61.45 C6.2 | 84.76,57.09 84.23,56.56 | 84.76,59.82 85.09,60.15 85.09,60.99 C16.1 84.61,64.02 84.63,64.04 R17.2 87.72,64.39 | 59.46,74.37 59.46,75.68 C13.1 | C14.1 67.96,65.34 | 59.46,74.37 56.97,71.88 | 59.2,61.27 59.26,61.27 | 28.32,47.35 C25.1 26.2,49.67 C18.1 | 44.11,46 C27.1 | 44.16,43.51 43.48,44.17 | 43.48,44.17 42.88,44.77 | 42.66,43.35 43.48,44.17 | IC1.5 65.08,47.66 64.17,46.76 | 73.04,43.73 73.97,44.66 | 21.37,33.66 21.43,33.72 | R44.2 84.32,36.82 84.32,36.41 | 85.54,49.66 R40.2 | 66.47,33.73 C22.2 65.34,33.84 | 67.32,33.66 67.14,33.84 67.82,33.84 69.09,33.84 | C32.1 84.8,33.38 84.8,32.54 84.51,32.25 | 84.51,29.52 84.19,29.2 83.94,28.95 | 59.17,46.76 59.17,48.07 C29.1 | C30.1 67.67,37.73 | 58.91,33.66 58.97,33.66 | C41.1 28.31,19.64 | 44.1,18.29 C43.1 | 44.15,15.79 43.48,16.46 | 43.48,16.46 42.88,17.07 | 42.65,15.64 43.48,16.46 | 59.16,19.05 64.16,19.05 65.06,19.95 IC5.5 68.44,21.25 70.92,18.77 70.92,15.08 C40.2 73.03,16.02 73.96,16.95 C47.1 | R71.2 84.33,8.72 84.31,8.7 | 85.53,21.95 R67.2 | 65.33,6.13 C38.2 | C48.1 84.79,5.67 84.79,4.83 84.5,4.54 | 59.16,19.05 59.16,20.36 C45.1 | C46.1 67.66,10.02 | 59.16,19.05 57.49,17.38 56.67,16.56 | 21.23,60.9 21.29,60.9 21.72,61.33
  pour Top (no thermals): -2.57,85.71 102.26,85.71 102.26,-3.86 -2.57,-3.86
N$1  (1 unrouted)
  Top 0.508: 34.71,67.29 34.98,67.07 34.46,67.07 | 31.68,69.84 INA826.6 32.16,69.84 34.71,67.29 | R26.2 38.51,64.66 39.11,65.26 39.11,69.05 39.91,69.84 U$1.7 | R26.1 34.62,67.29 C4.2 34.98,67.02 34.71,67.29
N$2
  Top 0.508: U$1.6 37.43,71.11 R4.1 37.29,70.74 37.43,70.6 C4.1
N$3
  Top 0.508: INA826.7 34.81,71.11 | R5.2 34.6,71.05 R4.2
  Top 0.61: 34.81,71.11 R4.2
N$4
  Top 0.508: R1.1 19.43,71.61 C3.1 19.51,72.72 22.17,75.38 C1.2
  Top 0.61: INA826.1 24.72,72.39 C1.2
N$5
  Top 0.508: INA826.4 24.62,68.58 23.72,67.67 C2.1 23.4,66.17 20.68,66.17 19.51,67.34 C3.2 19.39,69.51 R2.1
N$6
  Top 0.508: INA826.3 22.73,69.84 22.49,69.61 R3.2
N$7
  Top 0.508: INA826.2 22.52,71.11 R3.1
N$8  (2 unrouted)
  Top 0.508: R6.2 52.01,70.74 R18.1 | R5.1 41.99,79.07 47.48,79.07 R20.2 | U$1.2 48.01,69.84 R18.2 49.04,73.83 R20.1
N$9  (1 unrouted)
  Top 0.508: R19.2 53.06,66.87 55.03,68.84 R6.1 55.56,68.78 R7.2 | U$1.1 47.95,68.58 49.06,67.47 49.06,66.89 R19.1
N$10  (1 unrouted)
  Top 0.508: 61.73,68.44 R7.1 60.22,63.29 R8.2
N$11
  Top 0.508: 62.86,71.41 IC2.2 62.83,70.22 63.76,69.28 63.76,67.18 63.02,66.44 C5.1 | 62.86,71.41 62.86,72.77 63.26,73.17 66.86,73.17 67.06,72.97 67.06,71.66 R9.2 | IC2.1 61.59,71.41 62.86,71.41
N$12
  Top 0.508: C6.1 65.78,63.28 | C6.1 63.02,63.24 R8.1 | IC2.3 64.09,70.25 65.74,68.6 C6.1
N$13
  Top 0.4: 77.46,74.67 77.46,70.47
  Top 0.508: R9.1 C8.1 77.41,70.47 77.46,70.47 | R10.2 69.89,79.45 70.76,78.58 71.85,78.58 R11.2 73.4,78.73 77.46,74.67
N$14
  Top 0.508: IC2.6 64.09,77.75 64.86,78.52 64.86,79.27 C7.2 67.36,79.32 R10.1
N$15  (1 unrouted)
  Top 0.4: 84.26,78.87 84.26,75.66
  Top 0.508: R15.2 85.5,74.42 84.26,75.66 | R24.2 82.7,80.43 84.26,78.87 | IC2.7 62.83,79.14 C7.1 63.01,80.33 63.56,80.88 71.75,80.88 R11.1 76.68,80.63 R24.1
N$16
  Top 0.508: IC3.5 82.36,72.25 | 82.36,72.25 R14.1 | R15.1 86.64,72.25 82.36,72.25
N$17
  Top 0.508: R16.2 86.7,67.86 85.92,67.08 84.64,67.08 | 84.64,67.08 R17.1 | IC3.6 81.09,67.83 81.85,67.08 84.64,67.08
N$18
  Top 0.508: 82.68,76.97 82.52,76.8 R14.2 | 82.68,76.97 R13.1 | R12.2 82.63,77.02 82.68,76.97
N$19
  Top 0.4: R16.1 85.91,65.96 85.78,65.83 83.05,65.83 82.91,65.97 81.54,65.97 81.44,65.97 | 81.44,65.97 81.16,65.97 81.06,65.87 | 81.06,65.59 81.44,65.97
  Top 0.508: IC3.7 79.86,69.44 79.86,67.07 81.06,65.87 81.06,65.59 81.06,64.87 81.09,64.83 IC3.3 | R16.1 87.72,65.9
N$20  (2 unrouted)
  Top 0.508: 78.56,62.59 79.34,61.8 79.83,62.28 IC3.2 | 78.56,62.59 78.56,62.58 R22.1 | 78.56,62.59 IC3.1 | R22.2 82.83,59.09 R23.1 | SV2.1 90,41.77 90,55 86.42,58.58 R23.2
N$21
  Top 0.508: R1.2 13.26,76.96 9.79,73.49 9.79,49 SV1.13
N$22
  Top 0.508: R2.2 11.8,58.35 11.8,48.31 SV1.11
N$23
  Top 0.508: INA1.7 34.62,43.51 | R32.2 34.32,46.33 R28.2
  Top 0.61: 34.62,43.51 R28.2
N$24
  Top 0.508: U$2.6 37.11,43.51 R28.1 37.02,43.11 37.14,42.99 C17.1
N$25
  Top 0.508: R29.1 19.14,44 C19.1 19.22,45.11 21.88,47.77 C18.2
  Top 0.61: INA1.1 24.43,44.77 C18.2
N$26
  Top 0.508: INA1.4 24.34,40.97 23.43,40.06 C20.1 23.11,38.56 20.39,38.56 19.22,39.73 C19.2 19.1,41.9 R30.1
N$27
  Top 0.508: INA1.3 22.43,42.23 22.2,42 R31.2
N$28
  Top 0.508: INA1.2 22.23,43.51 R31.1
N$29  (1 unrouted)
  Top 0.508: 61.44,40.83 R34.1 59.93,35.68 R35.2
N$30
  Top 0.508: 62.57,43.8 IC1.2 62.53,42.6 63.47,41.67 63.47,39.57 62.73,38.83 C21.1 | 62.57,43.8 62.57,45.16 62.97,45.56 66.57,45.56 66.77,45.36 66.77,44.05 R36.2 | IC1.1 61.3,43.8 62.57,43.8
N$31
  Top 0.508: C22.1 65.49,35.67 | C22.1 62.73,35.63 R35.1 | IC1.3 63.8,42.63 65.45,40.99 C22.1
N$32
  Top 0.38: 77.17,47.06 77.17,42.86
  Top 0.508: R36.1 C24.1 77.12,42.86 77.17,42.86 | R37.2 69.6,51.84 70.47,50.97 71.56,50.97 R38.2 73.11,51.12 77.17,47.06
N$33
  Top 0.508: IC1.6 63.8,50.12 64.57,50.88 64.57,51.66 C23.2 67.07,51.71 R37.1
N$34  (1 unrouted)
  Top 0.4: 85.35,46.81 83.97,48.19 83.97,51.26
  Top 0.508: R42.2 85.35,46.81 | R51.2 82.41,52.82 83.97,51.26 | IC1.7 62.53,51.52 C23.1 62.72,52.72 63.27,53.27 71.46,53.27 R38.1 76.39,53.02 R51.1
N$35
  Top 0.508: IC4.5 82.08,44.63 | 82.08,44.63 R41.1 | R42.1 86.34,44.63 82.08,44.63
N$36
  Top 0.508: R39.2 82.45,49.41 | 82.45,49.41 R40.1 | 82.45,49.41 82.23,49.19 R41.2
N$37
  Top 0.406: 87.34,38.26 R43.1 85.54,38.35 85.46,38.27 82.72,38.27 82.62,38.36 81.32,38.36 81.22,38.26
  Top 0.508: IC4.7 79.57,41.83 79.57,39.46 80.77,38.26 | 80.77,38.26 80.77,37.81 | 80.77,37.81 80.77,37.26 80.81,37.23 IC4.3 | 80.77,38.26 81.22,38.26 80.77,37.81
N$38
  Top 0.508: R43.2 86.41,40.25 85.63,39.47 84.33,39.47 | 84.33,39.47 R44.1 | IC4.6 80.81,40.23 81.56,39.47 84.33,39.47
N$39  (2 unrouted)
  Top 0.508: R33.2 51.72,43.13 R45.1 | R32.1 41.76,51.46 47.19,51.46 R47.2 | U$2.2 47.72,42.23 R45.2 48.75,46.22 R47.1
N$40  (2 unrouted)
  Top 0.508: 78.27,34.98 79.06,34.2 79.53,34.67 IC4.2 | 78.27,34.98 78.27,34.97 R49.1 | 78.27,34.98 IC4.1 | R49.2 82.54,31.48 R50.1 | SV2.3 89,34.77 89,32.5 87.47,30.97 R50.2
N$41  (1 unrouted)
  Top 0.508: 34.42,39.68 34.7,39.46 34.17,39.46 | 31.39,42.23 INA1.6 31.86,42.23 34.42,39.68 | R53.2 38.22,37.05 38.82,37.65 38.82,41.44 39.62,42.23 U$2.7 | R53.1 C17.2 34.61,39.49 34.42,39.68
N$42  (1 unrouted)
  Top 0.508: R46.2 52.77,39.26 54.74,41.23 R33.1 55.27,41.17 R34.2 | U$2.1 47.66,40.97 48.77,39.86 48.77,39.28 R46.1
N$43
  Top 0.305: 8.6,42.56 11.1,42.56
  Top 0.508: R29.2 17.24,45.44 14.45,42.65 11.02,42.65 11.1,42.56 | SV1.8 8.6,42.56
N$44
  Top 0.508: R30.2 12.33,41.3 SV1.7
N$45
  Top 0.508: INA2.7 34.62,15.79 | R59.2 R55.2
  Top 0.61: 34.62,15.79 R55.2
N$46
  Top 0.508: U$3.6 37.08,15.79 R55.1 37,15.41 37.11,15.3 C33.1
N$47
  Top 0.508: C35.1 19.13,16.29 R56.1 | C35.1 18.81,16.21 | C34.2 21.87,20.06 19.21,17.4 C35.1
  Top 0.61: INA2.1 24.42,17.07 C34.2
N$48
  Top 0.508: INA2.4 24.32,13.26 23.42,12.35 C36.1 23.1,10.85 20.38,10.85 19.21,12.02 C35.2 19.09,14.19 R57.1
N$49
  Top 0.508: INA2.3 22.43,14.53 22.19,14.29 R58.2
N$50
  Top 0.508: INA2.2 22.21,15.79 R58.1
N$51  (1 unrouted)
  Top 0.508: 61.43,13.12 R61.1 59.92,7.97 R62.2
N$52
  Top 0.508: 62.56,16.09 IC5.2 62.52,14.89 63.46,13.96 63.46,11.86 62.72,11.12 C37.1 | 62.56,16.09 62.56,17.45 62.96,17.85 66.56,17.85 66.76,17.65 66.76,16.34 R63.2 | IC5.1 61.29,16.09 62.56,16.09
N$53
  Top 0.508: C38.1 65.48,7.96 | C38.1 62.72,7.92 R62.1 | IC5.3 63.8,14.94 65.44,13.29 C38.1
N$54
  Top 0.305: 77.11,15.15 77.11,15.82 77.16,15.87 77.16,19.35
  Top 0.508: R63.1 C40.1 77.11,15.15 77.16,15.15 | R64.2 69.59,24.13 70.46,23.26 71.55,23.26 R65.2 73.1,23.41 77.16,19.35
N$55
  Top 0.508: IC5.6 63.8,22.34 64.56,23.1 64.56,23.95 C39.2 67.06,24 R64.1
N$56  (1 unrouted)
  Top 0.406: 85.61,19.1 85.53,19.1 83.96,20.67 83.96,23.55
  Top 0.508: 85.61,19.1 R69.2 | R78.2 82.4,25.11 83.96,23.55 | IC5.7 62.52,23.82 C39.1 62.71,25.01 63.26,25.56 71.45,25.56 R65.1 76.38,25.31 R78.1
N$57
  Top 0.508: IC6.5 82.06,16.93 | 82.06,16.93 R68.1 | R69.1 86.33,16.93 82.06,16.93
N$58
  Top 0.508: R66.2 80.21,21.8 82.13,21.8 | 82.13,21.8 R67.1 | 82.13,21.8 82.22,21.71 R68.2
N$59
  Top 0.406: R70.1 85.61,10.64 85.48,10.51 82.76,10.51 82.61,10.65 81.21,10.65 | 80.76,10.55 80.86,10.65 81.21,10.65 | 81.21,10.65 80.77,10.21 80.76,10.21
  Top 0.508: IC6.7 79.56,14.12 79.56,11.75 80.76,10.55 80.76,10.21 80.76,9.55 80.8,9.52 IC6.3 | R70.1 87.42,10.5
N$60
  Top 0.508: R70.2 86.4,12.54 85.62,11.76 84.34,11.76 | 84.34,11.76 R71.1 | IC6.6 80.8,12.52 81.55,11.76 84.34,11.76
N$61  (2 unrouted)
  Top 0.508: R60.2 51.71,15.42 R72.1 | R59.1 41.7,23.75 47.18,23.75 R74.2 | U$3.2 47.71,14.53 R72.2 48.74,18.51 R74.1
N$62  (2 unrouted)
  Top 0.508: 78.25,7.28 79.05,6.49 79.53,6.96 IC6.2 | 78.25,7.28 78.25,7.26 R76.1 | 78.25,7.28 IC6.1 | R76.2 82.53,3.77 R77.1 | SV2.5 91.73,9.11 R77.2
N$63  (2 unrouted)
  Top 0.508: 34.41,11.97 34.69,11.75 34.16,11.75 | 31.39,14.53 INA2.6 31.86,14.53 31.91,14.47 C33.2 34.34,12.52 R80.1 | R80.2 38.71,9.84 38.81,9.94 38.81,13.73 39.6,14.53 U$3.7
N$64  (1 unrouted)
  Top 0.508: R73.2 52.76,11.55 54.73,13.52 R60.1 55.26,13.46 R61.2 | U$3.1 47.66,13.26 48.76,12.15 48.76,11.57 R73.1
N$65
  Top 0.508: SV1.3 13.5,32.59 13.5,25.37 R56.2
N$66
  Top 0.508: R57.2 9.87,16.04 SV1.1